# EAGLE schematic navi (EAGLE 7.5.0)
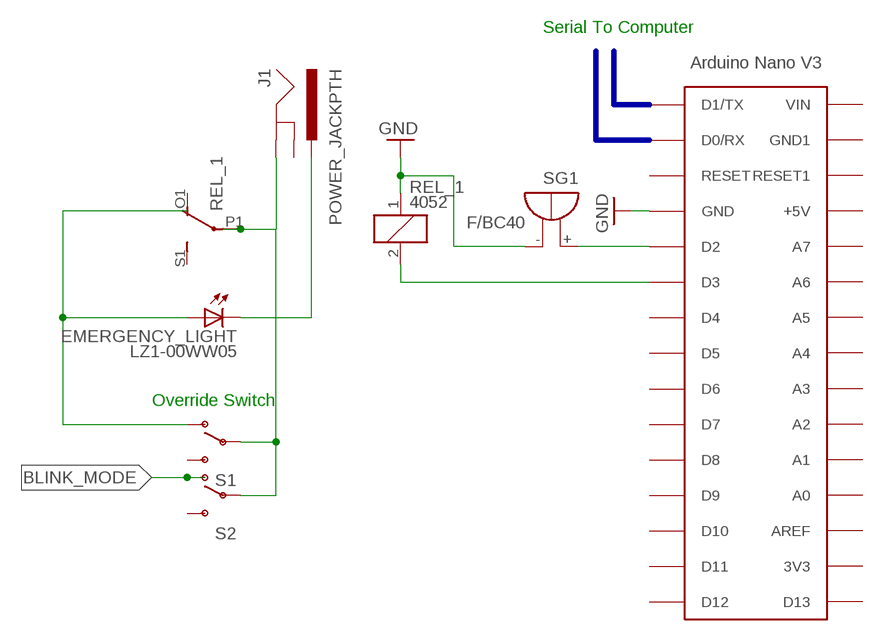
[diagram p0: schematic, sheet 1]

## Parts
EMERGENCY_LIGHT  LZ1-00WW05  [LZ1-00WW03]
J1  POWER_JACKPTH  [POWER_JACK_PTH]
REL_1  4052  [F4052]
S1  SWITCH-SPDTKIT  [SWITCH-SPDT_KIT]
S2  SWITCH-SPDTKIT  [SWITCH-SPDT_KIT]
SG1  F/BC40  [F/BC40]
U$1  ARDUINONANO  [PDIP-32]

## Nets
BLINK_MODE: S2.1(O)
GND: REL_1.1 SG1.- U$1.GND
N$1: SG1.+ U$1.D2
N$2: REL_1.2 U$1.D3
N$3: J1.GND REL_1.P1(2:P) S1.2(P) S2.2(P)
N$4: EMERGENCY_LIGHT.1(C) EMERGENCY_LIGHT.4(C) J1.PWR
N$5: EMERGENCY_LIGHT.2(A) EMERGENCY_LIGHT.3(A) EMERGENCY_LIGHT.5(A) S1.1(O)
Unconnected: J1.GNDBREAK REL_1.O1(2:O) REL_1.O2(3:O) REL_1.P2(3:P) REL_1.S1(2:S) REL_1.S2(3:S) S1.3(S) S2.3(S) U$1.3V3 U$1.+5V U$1.A0(A7) U$1.A1(A6) U$1.A2(A5) U$1.A3(A4) U$1.A4(A3) U$1.A5(A2) U$1.A6(A1) U$1.A7(A0) U$1.AREF U$1.D0/RX U$1.D1/TX U$1.D4 U$1.D5 U$1.D6 U$1.D7 U$1.D8 U$1.D9 U$1.D10 U$1.D11 U$1.D12 U$1.D13 U$1.GND1 U$1.RESET U$1.RESET1 U$1.VIN

## Buses
B$1
B$2

## Notes on the sheet
- Serial To Computer
- Override Switch

## Library data of the parts
EMERGENCY_LIGHT = led:LZ1-00WW05: High Luminous Efficacy 5W Warm White LED Source: http://www.ledengin.com/products/5wLZ/LZ1-00WW05.pdf
J1 = SparkFun-Connectors:POWER_JACK: Power Jack This is the standard 5.5mm barrel jack for power. The PTH is the most common, proven, reliable, footprint. The Slot footprint only works if the mill layer is transmitted to the PCB fab house so be warned. Mating wall wart : TOL-00298 (and others); PROD_ID: CONN-08197
REL_1 = relay:4052: RELAY 2 x switch, Finder; OC_FARNELL: unknown; OC_NEWARK: unknown
S1 S2 = SparkFun-Electromechanical:SWITCH-SPDT: SPDT Switch Simple slide switch, Spark Fun Electronics SKU : COM-00102 DPDT SMT slide switch, AYZ0202, SWCH-08179; PROD_ID: SWCH-08261
SG1 = buzzer:F/BC40: BUZZER Source: Spoerle; OC_FARNELL: unknown; OC_NEWARK: unknown
U$1 = CRE-Lib1:ARDUINONANO: Arduino Nano